# Altium schematic sheet Connectors.SchDoc
size Letter; Organization: UW Robotics; Address1: 200 University Avenue; Address2: Waterloo; Address3: Ontario; Address4: Canada N2L 3G6
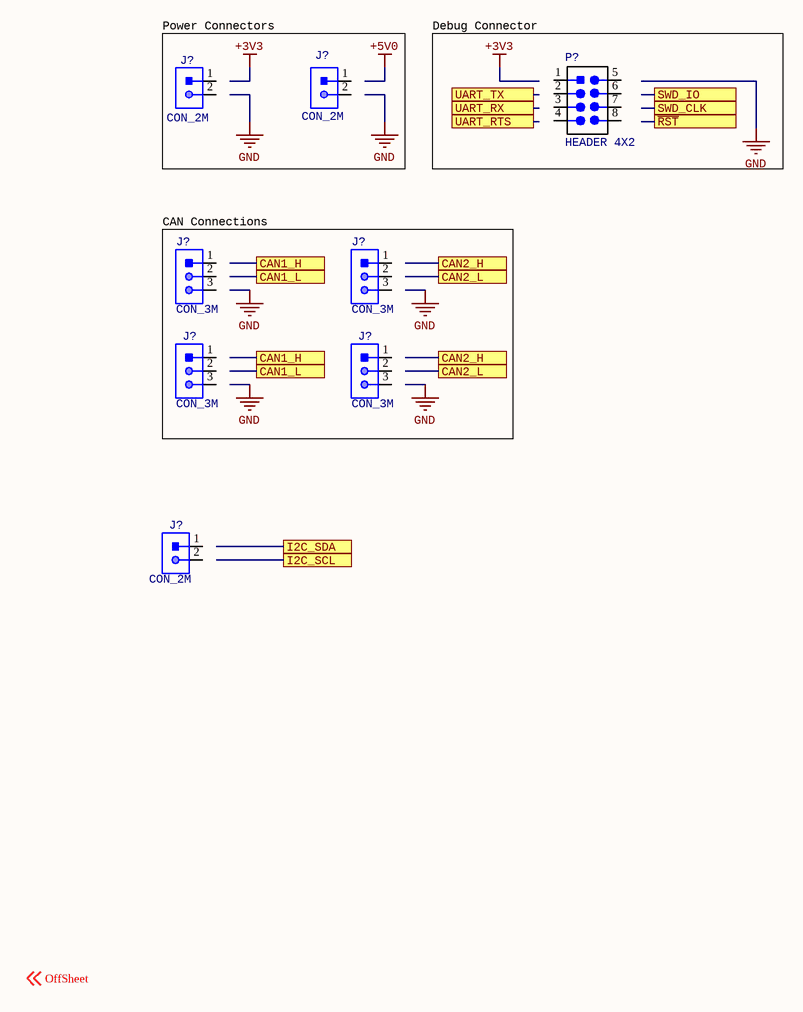
[diagram p0: Connectors.SchDoc]

## Parts
(Parts that share a designator on the sheet are numbered #1, #2 ... from top to bottom, then left to right.)
J?#1  CON_2M  [JST-B2B-PHSK]
J?#2  CON_2M  [JST-B2B-PHSK]
J?#3  CON_3M  [JST-B3B-SM4-TB]
J?#4  CON_3M  [JST-B3B-SM4-TB]
J?#5  CON_3M  [JST-B3B-SM4-TB]
J?#6  CON_3M  [JST-B3B-SM4-TB]
J?#7  CON_2M  [JST-B2B-PHSK]
P?  HEADER 4X2  [HEADER_2X4]

## Blocks framed on the sheet
Power Connectors: J?#1 J?#2
Debug Connector: P?
CAN Connections: J?#3-J?#6

## Ports
CAN1_H, CAN1_L, CAN2_H, CAN2_L, I2C_SCL, I2C_SDA, SWD_CLK, SWD_IO, UART_RTS, UART_RX, UART_TX, ~{RST}

## Nets

Not connected (* = marked no-connect by the designer): J?#1 1 2; J?#2 1 2; J?#3 1 2 3; J?#4 1 2 3; J?#5 1 2 3; J?#6 1 2 3; J?#7 1 2; P? 1(VCC) 2 3 4 5(GND) 6(2) 7(3) 8(4)

## Notes on the sheet
- Labels drawn without touching a wire or pin: OffSheet
- Title
- Size:
- Date:
- Letter
- Drawn By:
- Sheet
- of
- File:

## Library data of the parts
P? = HEADER 4X2: Header, 4-Pin Dual row; MPN: GRPB042VWVN-RC; Manufacturer: Sullins Connector Solutions; Digikey Part Number: S9015E-04-ND